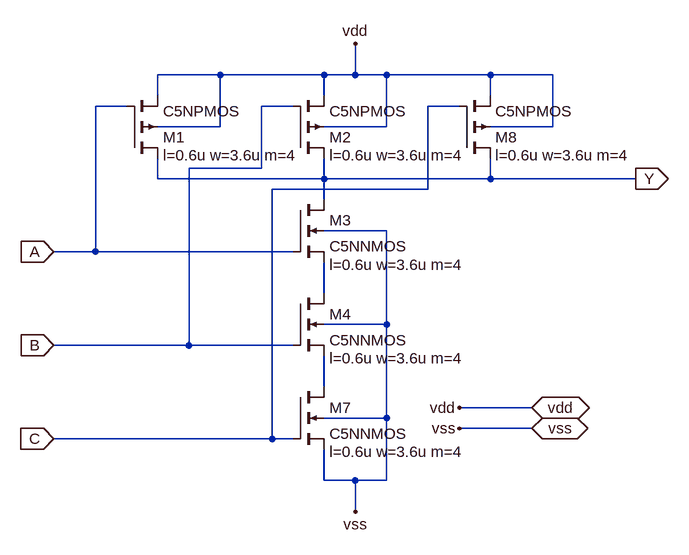
[diagram p0: schematic nand3_4x.asc]
nand3_4x.asc, the LTspice schematic file:
Version 4
SHEET 1 880 692
WIRE -464 -64 -560 -64
WIRE -304 -64 -464 -64
WIRE -256 -64 -256 -112
WIRE -256 -64 -304 -64
WIRE -208 -64 -256 -64
WIRE -48 -64 -208 -64
WIRE 48 -64 -48 -64
WIRE -560 -32 -560 -64
WIRE -304 -32 -304 -64
WIRE -48 -32 -48 -64
WIRE -608 -16 -656 -16
WIRE -352 -16 -400 -16
WIRE -96 -16 -144 -16
WIRE -464 16 -464 -64
WIRE -464 16 -560 16
WIRE -208 16 -208 -64
WIRE -208 16 -304 16
WIRE 48 16 48 -64
WIRE 48 16 -48 16
WIRE -400 80 -400 -16
WIRE -400 80 -512 80
WIRE -560 96 -560 64
WIRE -304 96 -304 64
WIRE -304 96 -560 96
WIRE -48 96 -48 64
WIRE -48 96 -304 96
WIRE 176 96 -48 96
WIRE -144 112 -144 -16
WIRE -144 112 -384 112
WIRE -304 128 -304 96
WIRE -208 176 -304 176
WIRE -656 208 -656 -16
WIRE -656 208 -720 208
WIRE -352 208 -656 208
WIRE -304 272 -304 224
WIRE -208 320 -208 176
WIRE -208 320 -304 320
WIRE -512 352 -512 80
WIRE -512 352 -720 352
WIRE -352 352 -512 352
WIRE -304 416 -304 368
WIRE -208 464 -208 320
WIRE 16 448 -96 448
WIRE -208 464 -304 464
WIRE 16 480 -96 480
WIRE -384 496 -384 112
WIRE -384 496 -720 496
WIRE -352 496 -384 496
WIRE -304 560 -304 512
WIRE -256 560 -304 560
WIRE -208 560 -208 464
WIRE -208 560 -256 560
WIRE -256 608 -256 560
FLAG -720 208 A
IOPIN -720 208 In
FLAG 176 96 Y
IOPIN 176 96 Out
FLAG -720 352 B
IOPIN -720 352 In
FLAG 16 448 vdd
IOPIN 16 448 BiDir
FLAG 16 480 vss
IOPIN 16 480 BiDir
FLAG -96 448 vdd
FLAG -96 480 vss
FLAG -256 -112 vdd
FLAG -256 608 vss
FLAG -720 496 C
IOPIN -720 496 In
SYMBOL pmos4 -608 64 M180
WINDOW 123 56 4 Left 2
SYMATTR Value2 l=0.6u w=3.6u m=4
SYMATTR InstName M1
SYMATTR Value C5NPMOS
SYMBOL pmos4 -352 64 M180
WINDOW 123 56 4 Left 2
SYMATTR Value2 l=0.6u w=3.6u m=4
SYMATTR InstName M2
SYMATTR Value C5NPMOS
SYMBOL nmos4 -352 128 R0
WINDOW 123 56 100 Left 2
SYMATTR Value2 l=0.6u w=3.6u m=4
SYMATTR InstName M3
SYMATTR Value C5NNMOS
SYMBOL nmos4 -352 272 R0
WINDOW 123 56 100 Left 2
SYMATTR Value2 l=0.6u w=3.6u m=4
SYMATTR InstName M4
SYMATTR Value C5NNMOS
SYMBOL nmos4 -352 416 R0
WINDOW 123 56 100 Left 2
SYMATTR Value2 l=0.6u w=3.6u m=4
SYMATTR InstName M7
SYMATTR Value C5NNMOS
SYMBOL pmos4 -96 64 M180
WINDOW 123 56 4 Left 2
SYMATTR Value2 l=0.6u w=3.6u m=4
SYMATTR InstName M8
SYMATTR Value C5NPMOS

The netlist it stands for:
* nand3_4x.asc
M1 Y A vdd vdd C5NPMOS l=0.6u w=3.6u m=4
M2 Y B vdd vdd C5NPMOS l=0.6u w=3.6u m=4
M3 Y A N001 vss C5NNMOS l=0.6u w=3.6u m=4
M4 N001 B N002 vss C5NNMOS l=0.6u w=3.6u m=4
M7 N002 C vss vss C5NNMOS l=0.6u w=3.6u m=4
M8 Y C vdd vdd C5NPMOS l=0.6u w=3.6u m=4
.model NMOS NMOS
.model PMOS PMOS
.lib standard.mos
.backanno
.end